# Altium schematic sheet Gateway.SchDoc
size B; SheetNumber: 2; SheetTotal: 2
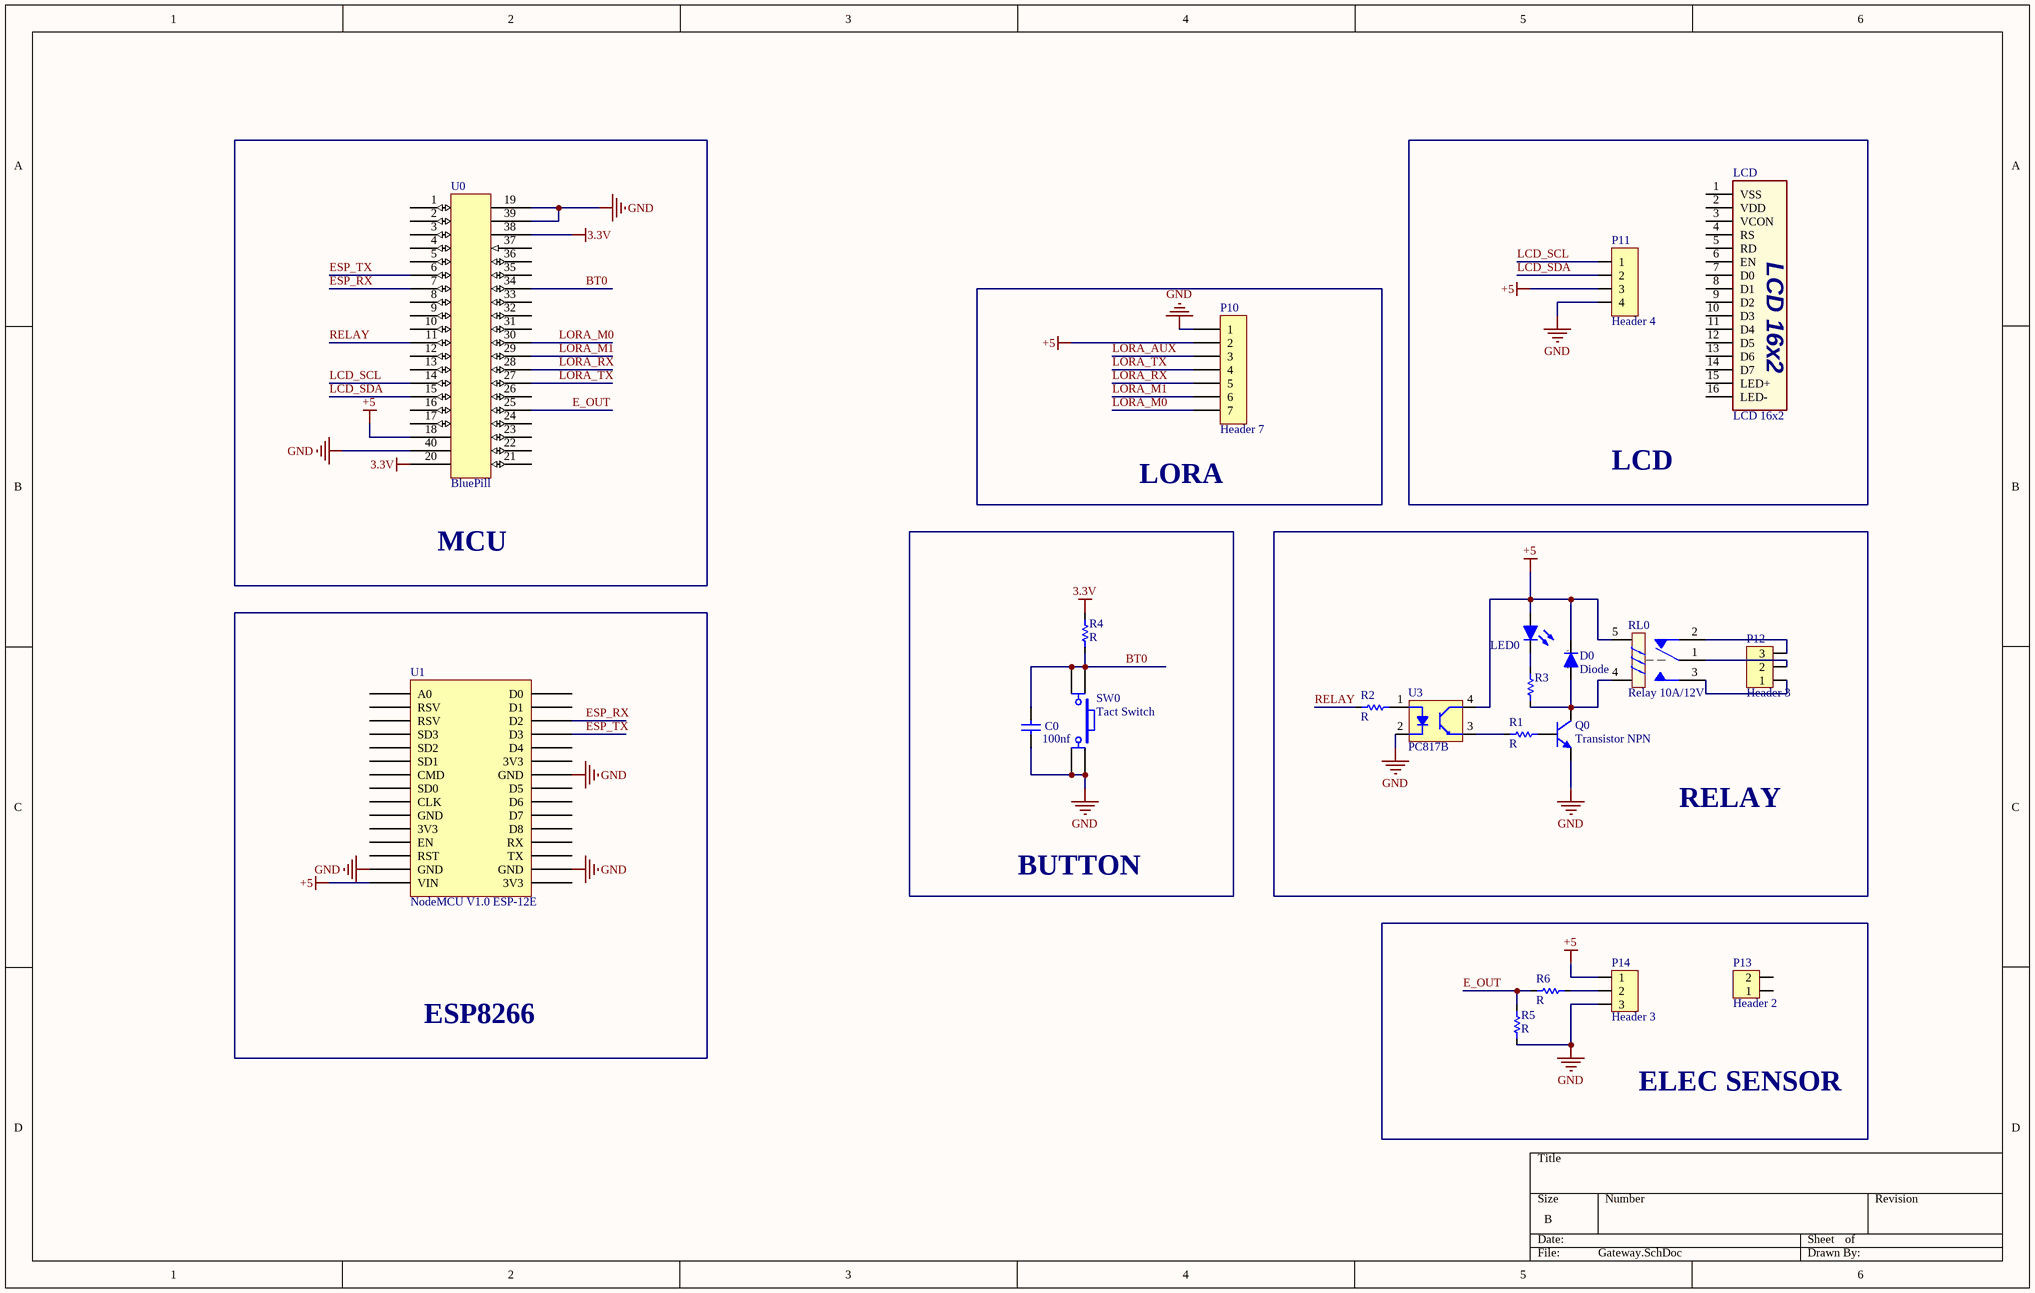
[diagram p0: Gateway.SchDoc]

## Parts
C0  100nf  [C 0805 (2012)]
D0  Diode  [SOD-80]
LCD  LCD 16x2  [LCD 16x2]
LED0  Led  [LED 3MM]  (value not drawn)
P10  Header 7  [Header 7]
P11  Header 4  [XH2.54-4P-RA]
P12  Header 3  [SH152-5.08-3P]
P13  Header 2  [HDR Domino 2 - 5MM]
P14  Header 3  [Header 3]
Q0  Transistor NPN  [SOT-23]
R1  R  [R 0805 (2012)]
R2  R  [R 0805 (2012)]
R3  R0  [R 0805 (2012)]  (value not drawn)
R4  R  [R 0805 (2012)]
R5  R  [R 0805 (2012)]
R6  R  [R 0805 (2012)]
RL0  Relay 10A/12V  [RL_SPDT_10A]
SW0  Tact Switch  [SW/4/DIP/SMALL]
U0  BluePill  [YAAJ_BluePill_1]
U1  NodeMCU V1.0 ESP-12E  [NodeMCU V1.0 ESP-12E]
U3  PC817B  [SOIC-4-GULLWING]

## Nets
3.3V: R4.1 U0.20 U0.38
+5: D0.1(Cathode) LED0.2(A) P10.2 P11.3 P14.1 RL0.5 U0.18 U1.VIN U3.4(C)
GND: C0.2 P10.1 P11.4 P14.3 Q0.2(E) R5.2 SW0.2 SW0.3 U0.19 U0.39 U0.40 U1.GND U3.2(K)
BT0: C0.1 R4.2 SW0.1 SW0.4 U0.34
E_OUT: R5.1 R6.2 U0.25
ESP_RX: U0.7 U1.D2
ESP_TX: U0.6 U1.D3
LCD_SCL: P11.1 U0.14
LCD_SDA: P11.2 U0.15
LORA_AUX: P10.3
LORA_M0: P10.7 U0.30
LORA_M1: P10.6 U0.29
LORA_RX: P10.5 U0.28
LORA_TX: P10.4 U0.27
RELAY: R2.2 U0.11
NetD0_2: D0.2(Anode) Q0.3(C) R3.1 RL0.4
NetLED0_1: LED0.1(K) R3.2
NetP12_1: P12.1 RL0.3
NetP12_2: P12.2 RL0.1
NetP12_3: P12.3 RL0.2
NetP14_2: P14.2 R6.1
NetQ0_1: Q0.1(B) R1.1
NetR1_2: R1.2 U3.3(E)
NetR2_1: R2.1 U3.1(A)

Not connected (* = marked no-connect by the designer): LCD 1(VSS) 2(VDD) 3(VCON) 4(RS) 5(RD) 6(EN) 7(D0) 8(D1) 9(D2) 10(D3) 11(D4) 12(D5) 13(D6) 14(D7) 15(LED+) 16(LED-); P13 1 2; U0 1 2 3 4 5 8 9 10 12 13 16 17 21 22 23 24 26 31 32 33 35 36 37; U1 3V3 A0 CLK CMD D0 D1 D4 D5 D6 D7 D8 EN RST RSV RX SD0 SD1 SD2 SD3 TX

## Notes on the sheet
- (near P10) LORA
- LCD
- MCU
- RELAY
- BUTTON
- ESP8266
- ELEC SENSOR
- (in symbol Diode) k; a

## Library data of the parts
C0 = Capacitor NP: Capacitor non-pol
D0 = Diode: Default Diode; Published: 8-Jun-2000; LatestRevisionDate: 17-Jul-2002; LatestRevisionNote: Re-released for DXP Platform.; PackageVersion: Sep-1996; PackageReference: SMC; Publisher: Altium Limited; Code_JEDEC: DO-214-AB
LCD = LCD 16x2: Character LCD 16x2
LED0 = Led: Typical LED
P10 = Header 7: Header, 7-Pin; LatestRevisionDate: 17-Jul-2002; LatestRevisionNote: Re-released for DXP Platform.; Publisher: Altium Limited
P11 = Header 4: Header, 4-Pin
P12 P14 = Header 3: Header, 3-Pin
P13 = Header 2: Header, 2-Pin; LatestRevisionDate: 17-Jul-2002; LatestRevisionNote: Re-released for DXP Platform.; Publisher: Altium Limited
Q0 = Transistor NPN: NPN Bipolar Transistor
R1-R6 = Resistor: Published: 8-Jun-2000; LatestRevisionDate: 17-Jul-2002; LatestRevisionNote: Re-released for DXP Platform.; PackageReference: AXIAL-0.3; Publisher: Altium Limited
RL0 = Relay 1: Relay SPDT,10A - 12VDC 5 Pin; Value: Relay SPDT, 10A, 12V
SW0 = SW SPST-4: Tact switch 4 pin
U1 = NodeMCU V1.0 ESP-12E: NodeMCU V1.0 ESP8266 (ESP-12E)
U3 = Opto PC817B